# EAGLE design nopoe (EAGLE 8.4.3)
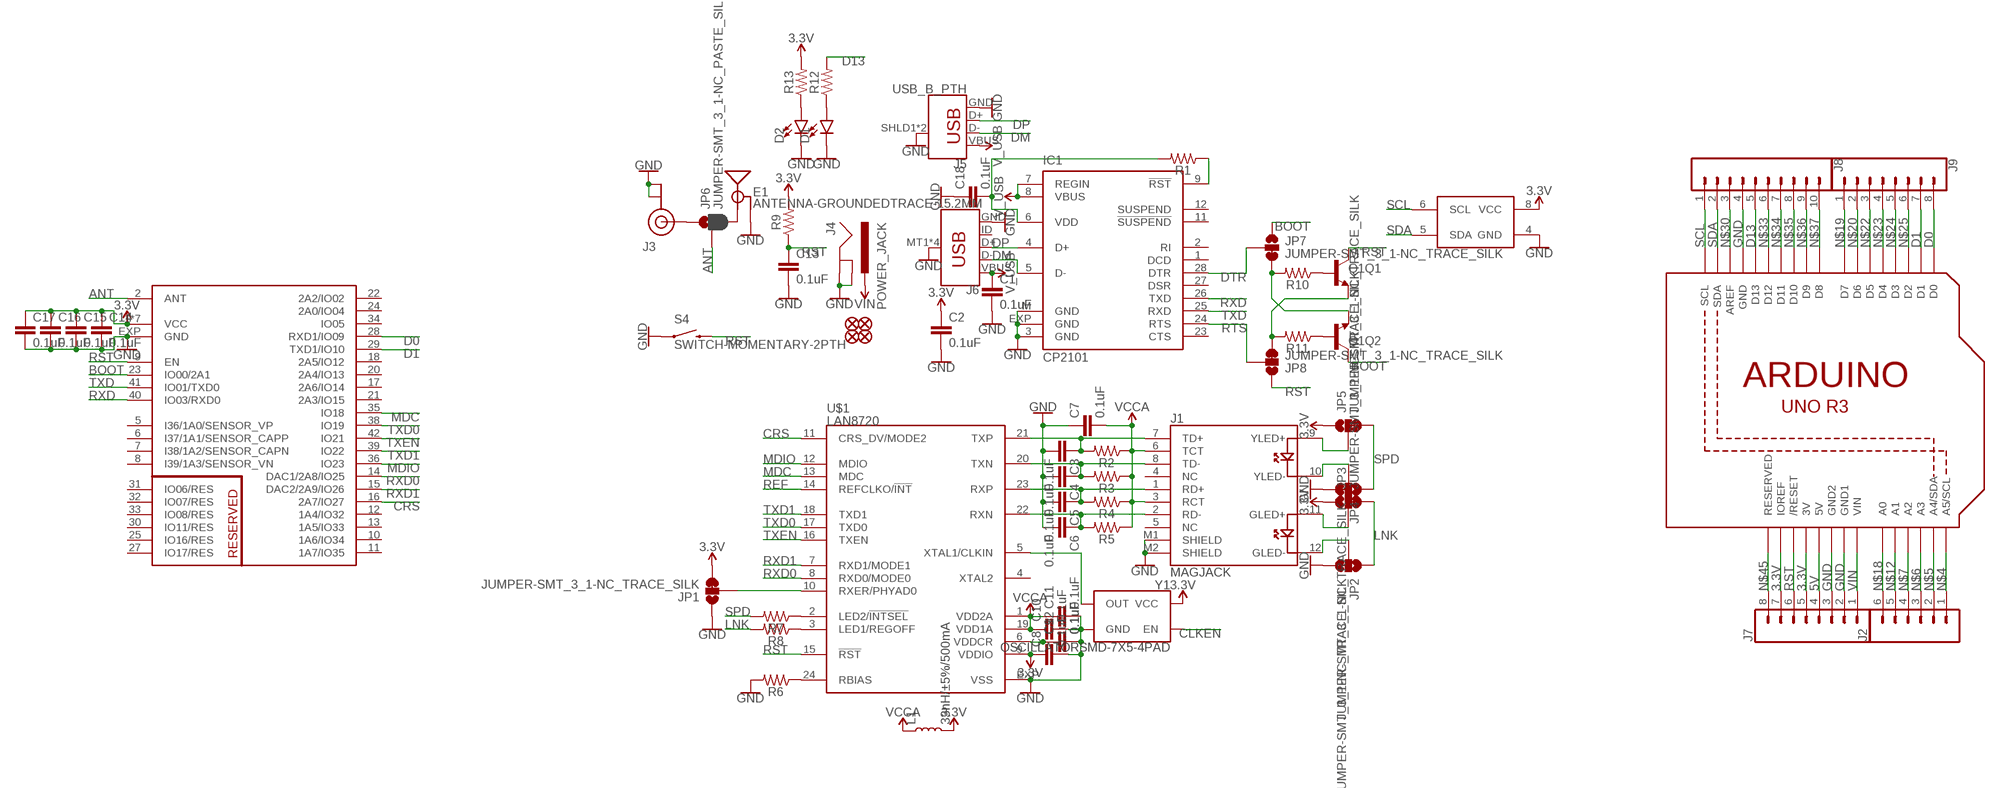
[diagram p0: schematic, sheet 1]

## Parts
C1  0.1uF  0.1UF-0603-25V-(+80/-20%)  [0603]
C2  0.1uF  0.1UF-0603-25V-(+80/-20%)  [0603]
C3  0.1uF  0.1UF-0603-25V-(+80/-20%)  [0603]
C4  0.1uF  0.1UF-0603-25V-(+80/-20%)  [0603]
C5  0.1uF  0.1UF-0603-25V-(+80/-20%)  [0603]
C6  0.1uF  0.1UF-0603-25V-(+80/-20%)  [0603]
C7  0.1uF  0.1UF-0603-25V-(+80/-20%)  [0603]
C8  0.1uF  0.1UF-0603-25V-(+80/-20%)  [0603]
C9  0.1uF  0.1UF-0603-25V-(+80/-20%)  [0603]
C10  0.1uF  0.1UF-0603-25V-(+80/-20%)  [0603]
C11  0.1uF  0.1UF-0603-25V-(+80/-20%)  [0603]
C12  0.1uF  0.1UF-0603-25V-(+80/-20%)  [0603]
C13  0.1uF  0.1UF-0603-25V-(+80/-20%)  [0603]
C14  0.1uF  0.1UF-0603-25V-(+80/-20%)  [0603]
C15  0.1uF  0.1UF-0603-25V-(+80/-20%)  [0603]
C16  0.1uF  0.1UF-0603-25V-(+80/-20%)  [0603]
C17  0.1uF  0.1UF-0603-25V-(+80/-20%)  [0603]
C18  0.1uF  0.1UF-0603-25V-(+80/-20%)  [0603]
D1  LED0603  [LED-0603]
D2  LED0603  [LED-0603]
E1  ANTENNA-GROUNDEDTRACE-15.2MM  [TRACE_ANTENNA_2.4GHZ_15.2MM]
FD1  FIDUCIAL1X2  [FIDUCIAL-1X2]
FD2  FIDUCIAL1X2  [FIDUCIAL-1X2]
FD3  FIDUCIAL1X2  [FIDUCIAL-1X2]
FD4  FIDUCIAL1X2  [FIDUCIAL-1X2]
IC1  CP2101  CP210X_USB_UART  [MLP28]
J1  MAGJACK  [MAGJACK]
J2  CONN_06NO_SILK_FEMALE_PTH  [1X06_NO_SILK]
J3  U.FL  [U.FL]
J4  POWER_JACK  [POWER_JACK_PTH]
J5  USB_B_PTH  [USB-B-PTH]
J6  USB_MICRO-B_SMT  [USB-MICROB]
J7  CONN_08NO_SILK_FEMALE_PTH  [1X08_NO_SILK]
J8  CONN_10NO_SILK_PTH_FEMALE  [1X10_NO_SILK]
J9  CONN_08NO_SILK_FEMALE_PTH  [1X08_NO_SILK]
JP1  JUMPER-SMT_3_1-NC_TRACE_SILK  [SMT-JUMPER_3_1-NC_TRACE_SILK]
JP2  JUMPER-SMT_3_1-NC_TRACE_SILK  [SMT-JUMPER_3_1-NC_TRACE_SILK]
JP3  JUMPER-SMT_3_1-NC_TRACE_SILK  [SMT-JUMPER_3_1-NC_TRACE_SILK]
JP4  JUMPER-SMT_3_1-NC_TRACE_SILK  [SMT-JUMPER_3_1-NC_TRACE_SILK]
JP5  JUMPER-SMT_3_1-NC_TRACE_SILK  [SMT-JUMPER_3_1-NC_TRACE_SILK]
JP6  JUMPER-SMT_3_1-NC_PASTE_SILK  [SMT-JUMPER_3_1-NC_PASTE_SILK]
JP7  JUMPER-SMT_3_1-NC_TRACE_SILK  [SMT-JUMPER_3_1-NC_TRACE_SILK]
JP8  JUMPER-SMT_3_1-NC_TRACE_SILK  [SMT-JUMPER_3_1-NC_TRACE_SILK]
L1  33nH/±5%/500mA  INDUCTOR-0603-33NH  [0603]
Q1  TRANS_NPN_DUAL-MBT3904DW1T1  [SC70-6]
R1  RESISTOR0603  [0603]
R2  RESISTOR0603  [0603]
R3  RESISTOR0603  [0603]
R4  RESISTOR0603  [0603]
R5  RESISTOR0603  [0603]
R6  RESISTOR0603  [0603]
R7  RESISTOR0603  [0603]
R8  RESISTOR0603  [0603]
R9  RESISTOR0603  [0603]
R10  RESISTOR0603  [0603]
R11  RESISTOR0603  [0603]
R12  RESISTOR0603  [0603]
R13  RESISTOR0603  [0603]
S4  SWITCH-MOMENTARY-2PTH  [TACTILE-PTH]
U1  ARDUINOR3-DIMENSION  [ARDUINOR3]
U2  ATSHA204_I2C-SSHDA-*  [SOIC-08]
U$1  LAN8720  [QFN24]
U$5  ESP32-PICO-D4  [QFN48_7X7]
Y1  OSCILLATORSMD-7X5-4PAD  [OSCILLATOR-SMD-7X5-4PAD]

## Nets
3.3V: C2.1 C8.1 C14.1 C15.1 C16.1 C17.1 J7.5 J7.7 JP1.3 JP3.1 JP5.1 L1.2 R9.2 R13.2 U1.3V U1.IOREF U2.8(VCC) U$1.9(VDDIO) U$5.1(VCC) U$5.3(VCC) U$5.4(VCC) U$5.19(VCC) U$5.37(VCC) U$5.43(VCC) U$5.46(VCC) Y1.4(VCC)
5V: J7.4 U1.5V
ANT: JP6.2 U$5.2(ANT)
BOOT: JP7.1 Q1.6(Q2:C) U$5.23(IO00/2A1)
CLKEN: Y1.1(EN)
CRS: U$1.11(CRS_DV/MODE2) U$5.16(2A7/IO27)
D0: J9.8 U1.D0 U$5.28(RXD1/IO09)
D1: J9.7 U1.D1 U$5.29(TXD1/IO10)
D13: J8.5 R12.2 U1.D13
DM: IC1.5(D-) J5.D- J6.D-
DP: IC1.4(D+) J5.D+ J6.D+
DTR: IC1.28(DTR) JP7.2
ECORE: C9.1 C12.1 U$1.6(VDDCR)
GND: C1.2 C2.2 C3.2 C4.2 C5.2 C6.2 C7.1 C8.2 C9.2 C10.2 C11.2 C12.2 C13.2 C14.2 C15.2 C16.2 C17.2 C18.1 D1.C D2.C E1.GND IC1.3(GND) IC1.EXP(GND) IC1.M(GND) J1.M1(SHIELD) J1.M2(SHIELD) J3.1(GND) J3.2(GND) J4.GND J4.GNDBREAK J5.GND J5.SHLD1(SHIELD) J5.SHLD2(SHIELD) J6.GND J6.MT1(SHIELD) J6.MT2(SHIELD) J6.P$1(SHIELD) J6.P$2(SHIELD) J7.2 J7.3 J8.4 JP1.1 JP2.3 JP4.3 R6.2 S4.1 S4.2 U1.GND U1.GND1 U1.GND2 U2.4(GND) U$1.EXP(VSS) U$5.EXP(GND) Y1.2(GND)
LNK: JP2.1 JP3.3 R8.2
MDC: U$1.13(MDC) U$5.35(IO18)
MDIO: U$1.12(MDIO) U$5.36(IO23)
N$3: IC1.9(!RST) R1.1
N$4: J2.1 U1.A5(A5/SCL)
N$5: J2.2 U1.A4(A4/SDA)
N$6: J2.3 U1.A3
N$7: J2.4 U1.A2
N$8: J1.12(GLED-) JP2.2
N$9: J1.11(GLED+) JP3.2
N$10: J1.10(YLED-) JP4.2
N$11: J1.9(YLED+) JP5.2
N$12: J2.5 U1.A1
N$13: R7.1 U$1.2(LED2/!INTSEL)
N$14: R8.1 U$1.3(LED1/REGOFF)
N$15: E1.ANT(SIGNAL) JP6.3
N$16: J3.FEED(SIGNAL) JP6.1
N$17: R6.1 U$1.24(RBIAS)
N$18: J2.6 U1.A0
N$19: J9.1 U1.D7
N$20: J9.2 U1.D6
N$21: JP1.2 U$1.10(RXER/PHYAD0)
N$22: J9.3 U1.D5
N$23: J9.4 U1.D4
N$24: J9.5 U1.D3
N$25: J9.6 U1.D2
N$26: U$1.5(XTAL1/CLKIN) Y1.3(OUT)
N$27: C18.2 IC1.6(VDD) R1.2
N$28: D1.A R12.1
N$29: Q1.5(Q1:B) R10.1
N$30: J8.3 U1.AREF
N$31: JP7.3 Q1.1(Q2:E) R10.2
N$32: D2.A R13.1
N$33: J8.6 U1.D12
N$34: J8.7 U1.D11
N$35: J8.8 U1.D10
N$36: J8.9 U1.D9
N$37: J8.10 U1.D8
N$38: Q1.2(Q2:B) R11.1
N$39: JP8.3 Q1.4(Q1:E) R11.2
N$45: J7.8 U1.RESERVED
REF: U$1.14(REFCLKO/!INT)
RST: C13.1 J7.6 JP8.1 Q1.3(Q1:C) R9.1 S4.3 S4.4 U1.RESET(/RESET) U$1.15(!RST) U$5.9(EN)
RTS: IC1.24(RTS) JP8.2
RXD: IC1.26(TXD) U$5.40(IO03/RXD0)
RXD0: U$1.8(RXD0/MODE0) U$5.14(DAC1/2A8/IO25)
RXD1: U$1.7(RXD1/MODE1) U$5.15(DAC2/2A9/IO26)
RXN: C6.1 J1.2(RD-) R5.2 U$1.22(RXN)
RXP: C5.1 J1.1(RD+) R4.2 U$1.23(RXP)
SCL: J8.1 U1.SCL U2.6(SCL)
SDA: J8.2 U1.SDA U2.5(SDA)
SPD: JP4.1 JP5.3 R7.2
TXD: IC1.25(RXD) U$5.41(IO01/TXD0)
TXD0: U$1.17(TXD0) U$5.38(IO19)
TXD1: U$1.18(TXD1) U$5.39(IO22)
TXEN: U$1.16(TXEN) U$5.42(IO21)
TXN: C4.1 J1.8(TD-) R3.2 U$1.20(TXN)
TXP: C3.1 J1.7(TD+) R2.2 U$1.21(TXP)
V_USB: C1.1 IC1.7(REGIN) IC1.8(VBUS) J5.VBUS J6.VBUS
VCCA: C7.2 C10.1 C11.1 J1.3(RCT) J1.6(TCT) L1.1 R2.1 R3.1 R4.1 R5.1 U$1.1(VDD2A) U$1.19(VDD1A)
VIN: J4.PWR J7.1 U1.VIN
Unconnected: IC1.1(DCD) IC1.2(RI) IC1.11(!SUSPEND) IC1.12(SUSPEND) IC1.23(CTS) IC1.27(DSR) J1.4(NC) J1.5(NC) J6.ID U$1.4(XTAL2) U$5.5(I36/1A0/SENSOR_VP) U$5.6(I37/1A1/SENSOR_CAPP) U$5.7(I38/1A2/SENSOR_CAPN) U$5.8(I39/1A3/SENSOR_VN) U$5.10(1A6/IO34) U$5.11(1A7/IO35) U$5.12(1A4/IO32) U$5.13(1A5/IO33) U$5.17(2A6/IO14) U$5.18(2A5/IO12) U$5.20(2A4/IO13) U$5.21(2A3/IO15) U$5.22(2A2/IO02) U$5.24(2A0/IO04) U$5.25(IO16/RES) U$5.27(IO17/RES) U$5.30(IO11/RES) U$5.31(IO06/RES) U$5.32(IO07/RES) U$5.33(IO08/RES) U$5.34(IO05)

## Library data of the parts
C1-C18 = SparkFun-Capacitors:0.1UF: 0.1µF ceramic capacitors A capacitor is a passive two-terminal electrical component used to store electrical energy temporarily in an electric field.; PROD_ID: CAP-00810
D1 D2 = SparkFun-LED:LED: LED (Generic) Standard schematic elements and footprints for 5mm, 3mm, 1206, and 0603 sized LEDs. Generic LEDs with no color specified.
E1 = SparkFun-RF:ANTENNA-GROUNDED: Antenna w/ Ground Connection 2.4GHz antennae with signal and ground terminals. TRACE_ANTENNA_2.4GHZ_15.2MM - Meander Trace antenna 15.2 x 5.7mm footprint Based on layout from TI app note AN043 <http://www.ti.com/lit/an/swra117d/swra117d.pdf>. TRACE_ANTENNA_2.4GHZ_25.7MM - Inverted F trace antenna 25.7 x 7.5 mm footprint. Based on layout from TI design note DN0007 <http://www.ti.com/lit/an/swru120b/swru120b.pdf>.
FD1-FD4 = SparkFun-Aesthetics:FIDUCIAL: Fiducial Alignment Points Point-of-reference for pick-and-place machines and other optical instruments.
IC1 = SparkFun-Retired:CP210X_USB_UART: Single-Chip USB to UART Bridge Source: www.silabs.com .. CP2101.pdf / cp2102.pdf. Spark Fun Electronics SKU : COM-00310 RETIRED: IC-00865; PROD_ID: COM-00310
J1 = SparkFun-Connectors:MAGJACK: MAGJACK: RJ-45 with LEDs This is a single port, RJ45 ethernet jacks with built in transformer (magnetics), status LEDs, and shielding. Here is the connector we sell at SparkFun: RJ45 Ethernet MagJack-Compatible <https://www.sparkfun.com/products/8534> (PRT-08534) Datasheet <http://www.sparkfun.com/datasheets/Prototyping/MagJack.pdf> It is used on this SparkFun product: SparkFun RJ45 MagJack Breakout <https://www.sparkfun.com/products/13021> (BOB-13021); PROD_ID: CONN-09556; SF_ID: PRT-08534
J2 = SparkFun-Connectors:CONN_06: Multi connection point. Often used as Generic Header-pin footprint for 0.1 inch spaced/style header connections On any of the 0.1 inch spaced packages, you can populate with these: Break Away Headers - Straight <https://www.sparkfun.com/products/116> (PRT-00116) Break Away Male Headers - Right Angle <https://www.sparkfun.com/products/553> (PRT-00553) Female Headers <https://www.sparkfun.com/products/115> (PRT-00115) Break Away Headers - Machine Pin <https://www.sparkfun.com/products/117> (PRT-00117) Break Away Female Headers - Swiss Machine Pin <https://www.sparkfun.com/products/743> (PRT-00743) Arduino Stackable Header - 6 Pin <https://www.sparkfun.com/products/9280> (PRT-09280) For SCREWTERMINALS and SPRING TERMINALS visit here: Screw Terimnals on SparkFun.com <https://www.sparkfun.com/search/results?term=Screw+Terminals> (5mm/3.5mm/2.54mm spacing) This device is also useful as a general connection point to wire up your design to another part of your project. Our various solder wires solder well into these plated through hole pads. Hook-Up Wire - Assortment (Stranded, 22 AWG) <https://www.sparkfun.com/products/11375> (PRT-11375) Hook-Up Wire - Assortment (Solid Core, 22 AWG) <https://www.sparkfun.com/products/11367> (PRT-11367) View the entire wire category on our website here <https://www.sparkfun.com/categories/141>; PROD_ID: CONN-08437
J3 = SparkFun-Connectors:U.FL: SMD Antenna Connector - U.FL 2mm height, 3.0mm x 3.0mm receptacle size. SparkFun Products: SparkFun WiFi Shield - ESP8266 <https://www.sparkfun.com/products/13287> SparkFun ESP8266 Thing <https://www.sparkfun.com/products/13231> SparkFun MiniGen - Pro Mini Signal Generator Shield <https://www.sparkfun.com/products/11420>; PROD_ID: CONN-09193; SF_ID: WRL-09144
J4 = SparkFun-Connectors:POWER_JACK: Power Jack Connector This is the standard 5.5mm barrel jack for power. The PTH is the most common, proven, reliable, footprint. The Slot footprint only works if the mill layer is transmitted to the PCB fab house so be warned. Here are the connectors we sell at SparkFun: DC Barrel Power Jack/Connector <https://www.sparkfun.com/products/119> (PRT-00119) DC Barrel Power Jack/Connector (SMD) <https://www.sparkfun.com/products/12748> (PRT-12748) DC Barrel Jack Adapter - Breadboard Compatible <https://www.sparkfun.com/products/10811> (PRT-10811) It is used on this SparkFun product (and many, many others): SparkFun RedBoard - Programmed with Arduino <https://www.sparkfun.com/products/12757> (DEV-12757) Also, if you need a mating power supply or connector, please check these out: Wall Adapter Power Supply - 9VDC 650mA <https://www.sparkfun.com/products/298> (TOL-00298) DC Barrel Jack Adapter - Male <https://www.sparkfun.com/products/10287> (PRT-10287); PROD_ID: CONN-08197
J5 = SparkFun-Connectors:USB_B: USB Type B Connector SparkFun Products: SparkFun Stepoko <https://www.sparkfun.com/products/13899> PTH; PROD_ID: CONN-08278; SF_ID: PRT-00139
J6 = SparkFun-Connectors:USB_MICRO-B: USB Type Micro-B Connector Male/female and PTH/SMT variants SparkFun Products: SparkFun microB USB Breakout <https://www.sparkfun.com/products/12035> SparkFun USB microB Plug Breakout <https://www.sparkfun.com/products/10031> SparkFun ESP8266 Thing <https://www.sparkfun.com/products/13231>; PROD_ID: CONN-09505; SF_ID: PRT-08533
J7 J9 = SparkFun-Connectors:CONN_08: Multi connection point. Often used as Generic Header-pin footprint for 0.1 inch spaced/style header connections On any of the 0.1 inch spaced packages, you can populate with these: Break Away Headers - Straight <https://www.sparkfun.com/products/116> (PRT-00116) Break Away Male Headers - Right Angle <https://www.sparkfun.com/products/553> (PRT-00553) Female Headers <https://www.sparkfun.com/products/115> (PRT-00115) Break Away Headers - Machine Pin <https://www.sparkfun.com/products/117> (PRT-00117) Break Away Female Headers - Swiss Machine Pin <https://www.sparkfun.com/products/743> (PRT-00743) Arduino Stackable Header - 8 Pin <https://www.sparkfun.com/products/9279> (PRT-09279) For SCREWTERMINALS and SPRING TERMINALS visit here: Screw Terimnals on SparkFun.com <https://www.sparkfun.com/search/results?term=Screw+Terminals> (5mm/3.5mm/2.54mm spacing) This device is also useful as a general connection point to wire up your design to another part of your project. Our various solder wires solder well into these plated through hole pads. Hook-Up Wire - Assortment (Stranded, 22 AWG) <https://www.sparkfun.com/products/11375> (PRT-11375) Hook-Up Wire - Assortment (Solid Core, 22 AWG) <https://www.sparkfun.com/products/11367> (PRT-11367) View the entire wire category on our website here <https://www.sparkfun.com/categories/141> Special notes: Molex polarized connector foot print use with SKU : PRT-08231 with associated crimp pins and housings. 1MM SMD Version SKU: PRT-10208 NOTES ON THE VARIANTS LOCK and LOCK_LONGPADS... This footprint was designed to help hold the alignment of a through-hole component (i.e. 6-pin header) while soldering it into place. You may notice that each hole has been shifted either up or down by 0.005 of an inch from it's more standard position (which is a perfectly straight line). This slight alteration caused the pins (the squares in the middle) to touch the edges of the holes. Because they are alternating, it causes a "brace" to hold the component in place. 0.005 has proven to be the perfect amount of "off-center" position when using our standard breakaway headers. Although looks a little odd when you look at the bare footprint, once you have a header in there, the alteration is very hard to notice. Also,if you push a header all the way into place, it is covered up entirely on the bottom side.; PROD_ID: CONN-08438
J8 = SparkFun-Connectors:CONN_10: Multi connection point. Often used as Generic Header-pin footprint for 0.1 inch spaced/style header connections On any of the 0.1 inch spaced packages, you can populate with these: Break Away Headers - Straight <https://www.sparkfun.com/products/116> (PRT-00116) Break Away Male Headers - Right Angle <https://www.sparkfun.com/products/553> (PRT-00553) Female Headers <https://www.sparkfun.com/products/115> (PRT-00115) Break Away Headers - Machine Pin <https://www.sparkfun.com/products/117> (PRT-00117) Break Away Female Headers - Swiss Machine Pin <https://www.sparkfun.com/products/743> (PRT-00743) Arduino Stackable Header - 10 Pin <https://www.sparkfun.com/products/11376> (PRT-11376) For SCREWTERMINALS and SPRING TERMINALS visit here: Screw Terimnals on SparkFun.com <https://www.sparkfun.com/search/results?term=Screw+Terminals> (5mm/3.5mm/2.54mm spacing) This device is also useful as a general connection point to wire up your design to another part of your project. Our various solder wires solder well into these plated through hole pads. Hook-Up Wire - Assortment (Stranded, 22 AWG) <https://www.sparkfun.com/products/11375> (PRT-11375) Hook-Up Wire - Assortment (Solid Core, 22 AWG) <https://www.sparkfun.com/products/11367> (PRT-11367) View the entire wire category on our website here <https://www.sparkfun.com/categories/141> Special notes: Molex polarized connector foot print use with SKU : PRT-08231 with associated crimp pins and housings. 1MM SMD Version SKU: PRT-10208 NOTES ON THE VARIANTS LOCK and LOCK_LONGPADS... This footprint was designed to help hold the alignment of a through-hole component (i.e. 6-pin header) while soldering it into place. You may notice that each hole has been shifted either up or down by 0.005 of an inch from it's more standard position (which is a perfectly straight line). This slight alteration caused the pins (the squares in the middle) to touch the edges of the holes. Because they are alternating, it causes a "brace" to hold the component in place. 0.005 has proven to be the perfect amount of "off-center" position when using our standard breakaway headers. Although looks a little odd when you look at the bare footprint, once you have a header in there, the alteration is very hard to notice. Also,if you push a header all the way into place, it is covered up entirely on the bottom side.; PROD_ID: CONN-11563
JP1-JP5 JP7 JP8 = SparkFun-Jumpers:JUMPER-SMT_3_1-NC_TRACE: Normally closed trace jumper (1 of 2 connections) This jumper has a trace between two pads so it's normally closed (NC). The other connection is normally open (NO). Use a razor knife to open the connection. For best results follow the IPC guidelines for cutting traces: Cutout at least 0.063 mm (0.005 in). Remove all loose material to clean up the cut area. Seal the cut with an approved epoxy. Reapply solder to reclose the connection, or to close the NO connection.
JP6 = SparkFun-Jumpers:JUMPER-SMT_3_1-NC_PASTE: Normally closed solder jumper (1 of 2 connections) This jumper has an aperture in the stencil to allow solder paste to bridge one of the two connections. One connection is normally closed (NC), while the other is normally open (NO). Wick off the solder to open the connection. Reapply solder to reclose the connection. Apply solder to the other side instead to change the current path.
L1 = SparkFun-Coils:INDUCTOR: Inductors Resist changes in electrical current. Basically a coil of wire. SparkFun Products: SparkFun Load Cell Amplifier - HX711 <https://www.sparkfun.com/products/13879> IOIO-OTG - V2.2 <https://www.sparkfun.com/products/13613>; PROD_ID: NDUC-07874
Q1 = SparkFun-DiscreteSemi:TRANS_NPN_DUAL: Dual NPN Transistors in Single Package The MBT3904W1 puts two general purpose 3904 NPN transistors in a single package. Datasheet <http://www.onsemi.com/pub_link/Collateral/MBT3904DW1T1-D.PDF> SparkFun Products: SparkFun ESP32 Thing <https://www.sparkfun.com/products/13907>; PROD_ID: TRANS-13337
R1-R13 = SparkFun-Resistors:RESISTOR: Generic Resistor Package
S4 = maxorig:SWITCH-MOMENTARY-2: Various NO switches- pushbuttons, reed, etc; PROD_ID: SWCH-08441
U1 = adafruit:ARDUINOR3: This is a new object for the new Arduino R3 - with extra pins that you may want to use (such as IOref, and duplicated A4/A5
U2 = maxorig:ATSHA204_I2C: ATSHA204 I2C - Atmel Crypto Element w/ 4.5Kb EEPROM The Atmel ATSHA204 is an optimized authentication chip that includes a 4.5Kb EEPROM. This array can be used for storage of keys, miscellaneous read/write, read-only, password or secret data, and consumption tracking. Access to the various sections of memory can be restricted in a variety of ways and then the configuration locked to prevent changes. This part is for the I2C version of the ATSHA204A. Technical specifications: Supply voltage: 2.0-5.5V Communication voltage: 1.8-5.5V 512 bit OTP (One Time Programmable) region Guaranteed unique 72-bit serial number Internal, high-quality RNG (Random Number Generator) Hardware SHA-256 accelerator
U$1 = microchip-smsc-lan8720:LAN8720: LAN8720A/LAN8720Ai Small Footprint RMII 10/100 Ethernet PHY Transceiver with HP Auto-MDIX Support from SMSC / Microchip <http://www.microchip.com>. (C) 2014 Tomasz Boleslaw CEDRO, cederom@tlen.pl, http://www.tomek.cedro.info. Version 0.1 (2014-01-04): Initial release.
U$5 = maxorig:ESP32-PICO-D4: ESP32-PICO-D4 - ESP32 with integrated flash and passives This SIP (System In Package) integrates the amazing ESP32 wifi capable microcontroller along with an SPI flash chip, crystal, RF passives, and decoupling capacitors. You can use this piece just like the ESP32 but without the need for RF design or picking a suitable flash chip and passives. Reserved pins are attached internally to the flash chip, and should be left disconnected unless you are sure your application requires it. Techinical specifications: VCC: 3.3V Flash size: 4Mbytes ADC resolution: 12 bits Generally usable ADC pins: 13 Truly usable IO: 21 Total IO: 34
Y1 = SparkFun-Clocks:OSCILLATOR: Oscillators (Generic) These are active oscillators, which require a power source to generate their clock output. Most oscillators are configured to generate a set frequency (e.g. 16MHz). They have four pins: power, ground, output, and an enable input.

## Board
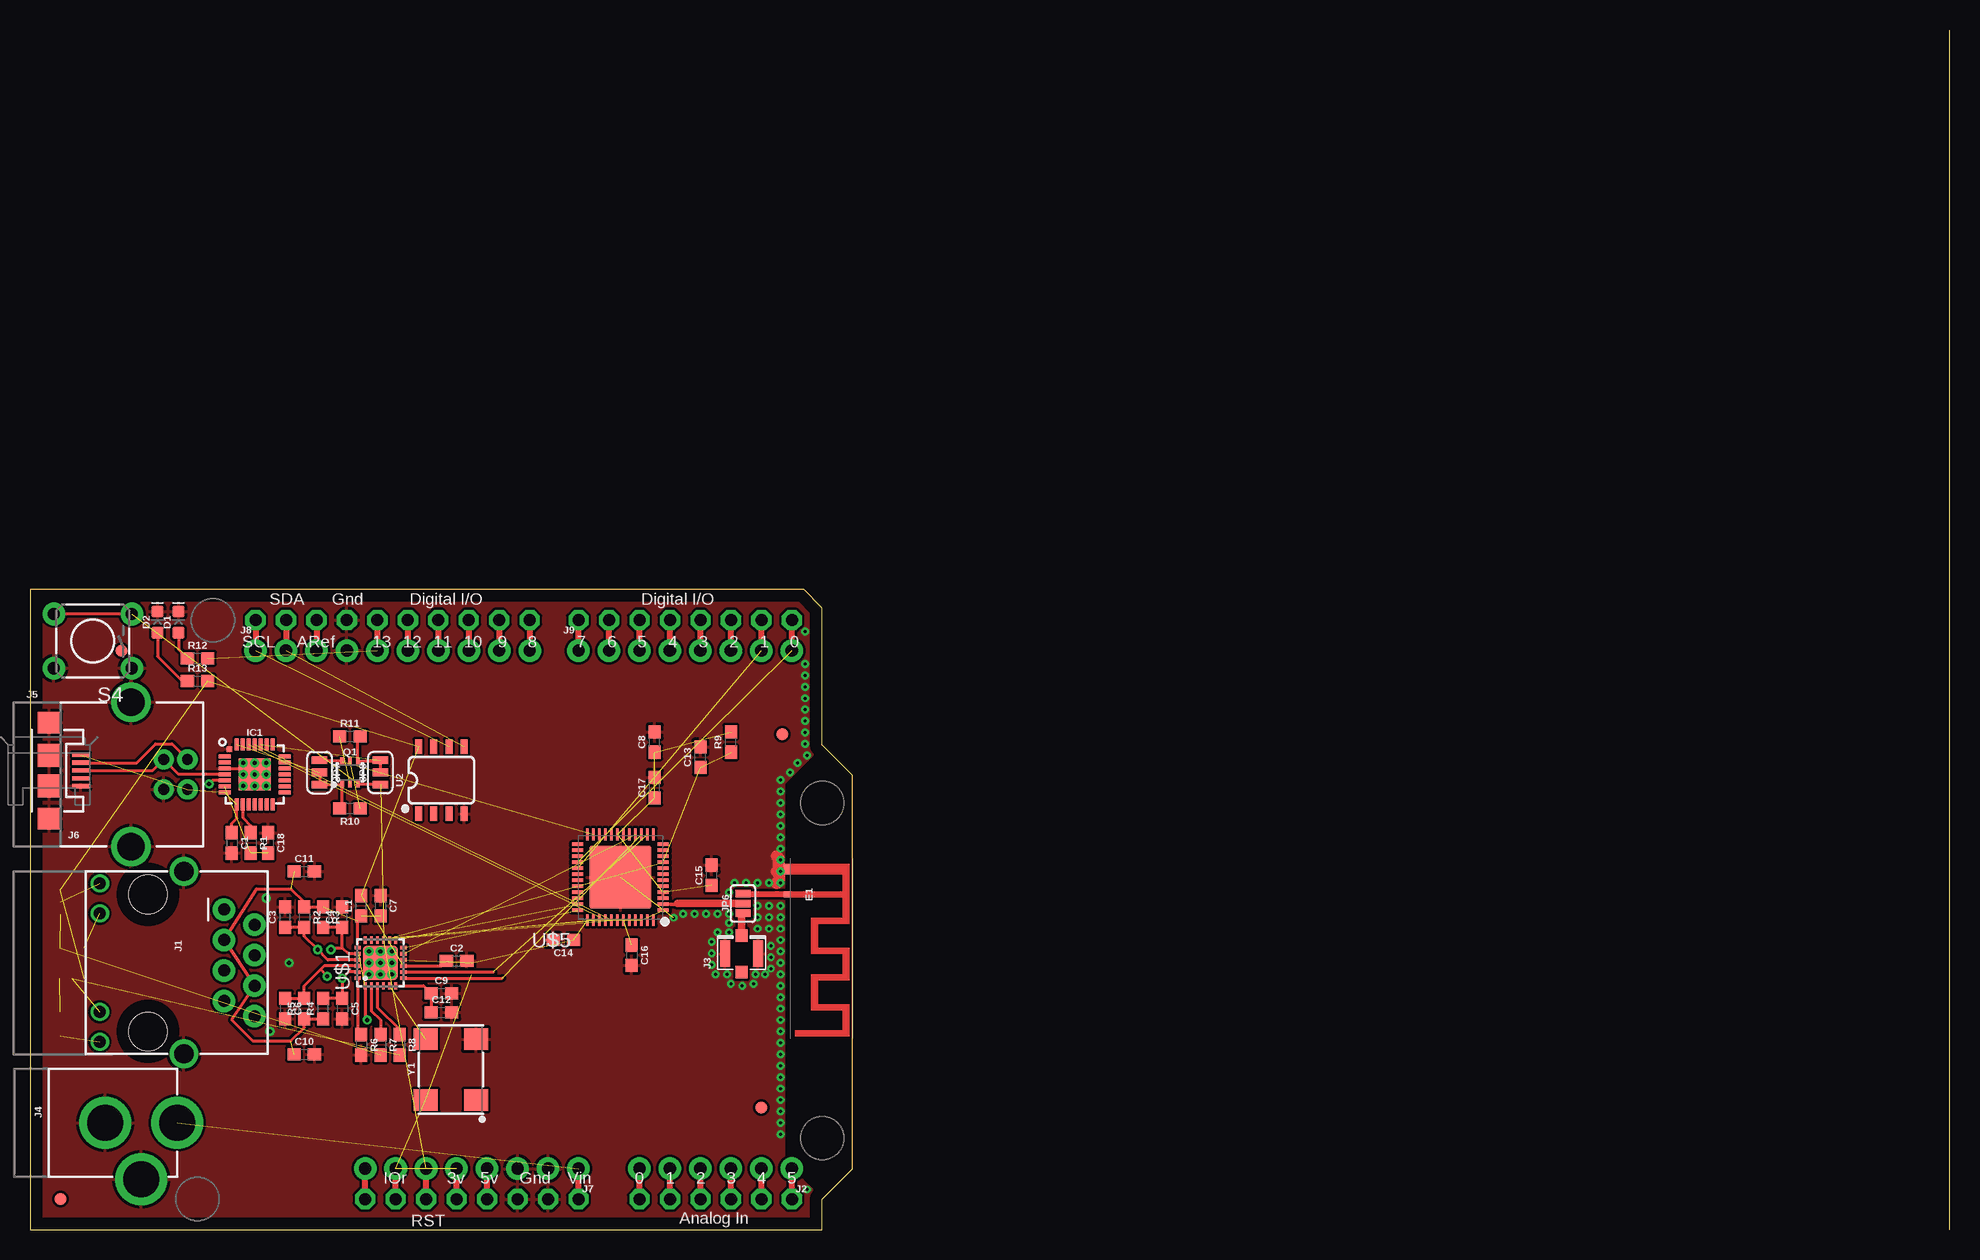
[diagram p1: board, top side]
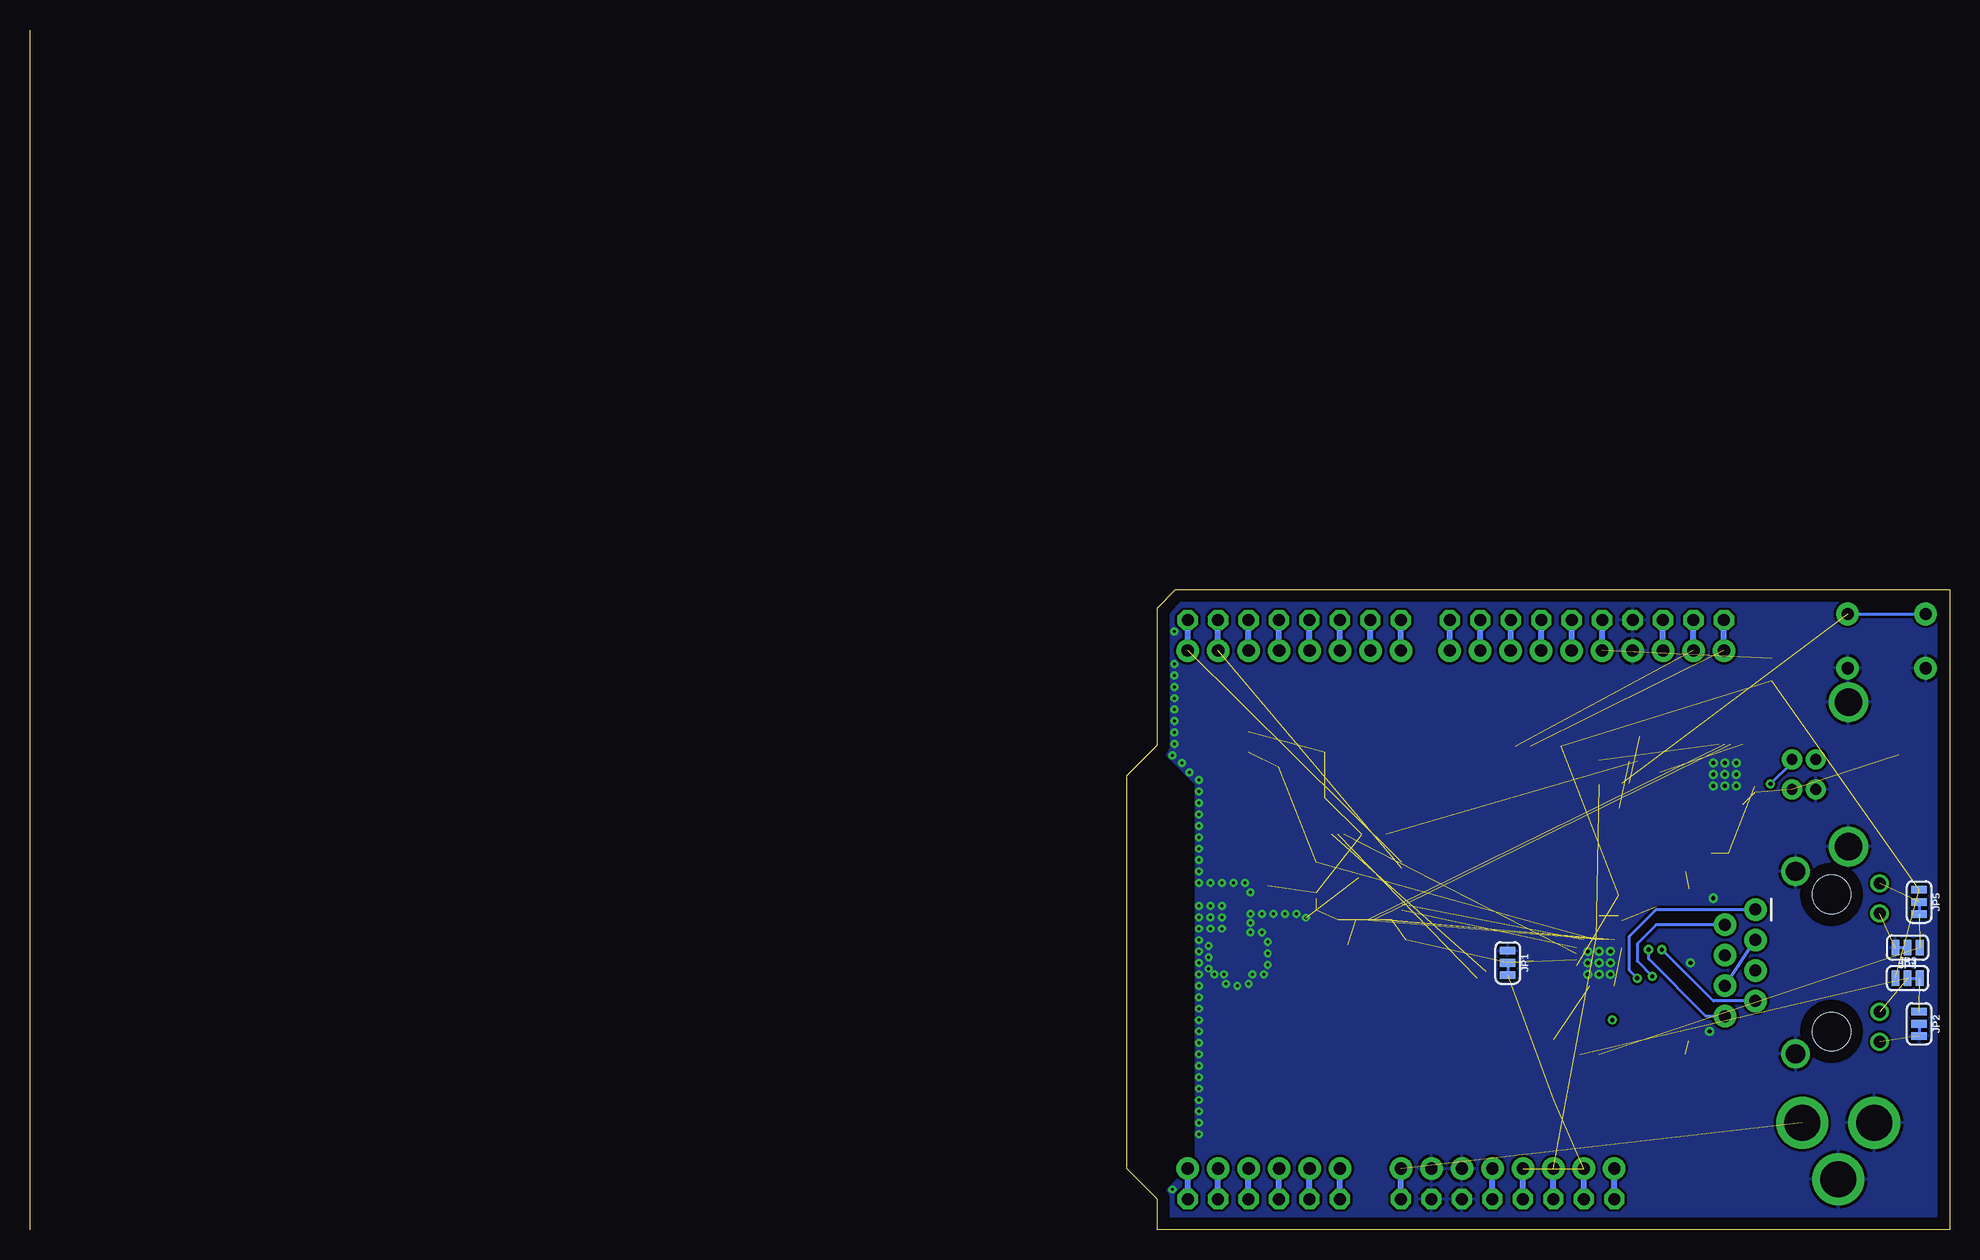
[diagram p2: board, bottom side, seen from below]

Size 160 x 100 mm. Coordinates in mm from the lower left corner, seen from the top.
Outline: 160,0 160,100
Copper layers (1*16): Top 0.035mm / dielectric 1.5mm / Bottom 0.035mm
Design rules "default": minimum track width 10mil, minimum drill 24mil, track to track 8mil, track to pad 8mil, pad to pad 8mil, via to via 8mil, smd to smd 8mil, copper to edge 40mil, drill to drill 8mil, minimum pad ring 10mil, minimum via ring 8mil, stop-mask expansion 4mil, vias tented up to drill 0mil, thermal gap 10mil

### Footprints (pad centres in the part's own frame; a part is rotated, then mirrored left to right if it is on the bottom)
0603 = smd 1.1 x 1: 1 -0.85,0; 2 0.85,0
LED-0603 = smd 1 x 1: A -0.877,0; C 0.877,0
TRACE_ANTENNA_2.4GHZ_15.2MM = smd 0.5 x 0.5: ANT 0,-0.25 | smd 0.9 x 0.5: GND -2.1,-0.25
FIDUCIAL-1X2 = smd 1 x 1: 1 0,0
MLP28 = smd 1 x 0.3: 1 -2.5,1.5; 2 -2.5,1; 3 -2.5,0.5; 4 -2.5,0; 5 -2.5,-0.5; 6 -2.5,-1; 7 -2.5,-1.5; 15 2.5,-1.5; 16 2.5,-1; 17 2.5,-0.5; 18 2.5,0; 19 2.5,0.5; 20 2.5,1; 21 2.5,1.5 | smd 0.3 x 1: 8 -1.5,-2.5; 9 -1,-2.5; 10 -0.5,-2.5; 11 0,-2.5; 12 0.5,-2.5; 13 1,-2.5; 14 1.5,-2.5; 22 1.5,2.5; 23 1,2.5; 24 0.5,2.5; 25 0,2.5; 26 -0.5,2.5; 27 -1,2.5; 28 -1.5,2.5 | smd 2.7 x 2.7: EXP 0,0 | smd 0.435 x 0.435: M -2.103,2.103
MAGJACK = drill 1 pad 1.88: 1 3.175,17.445; 2 4.445,19.985; 3 5.715,17.445; 4 6.985,19.985; 5 8.255,17.445; 6 9.525,19.985; 7 10.795,17.445; 8 12.065,19.985 | drill 1 pad 1.27: 9 1,7.1; 10 3.5,7.1; 11 11.7,7.1; 12 14.2,7.1 | drill 1.6 pad 2.184: M1 0,14.1; M2 15.2,14.1 | hole 3.2: 1.905,11.095; 13.335,11.095
1X06_NO_SILK = drill 1.016 pad 1.88: 1 0,0; 2 2.54,0; 3 5.08,0; 4 7.62,0; 5 10.16,0; 6 12.7,0
U.FL = smd 2.2 x 0.85: 1 0,1.375; 2 0,-1.375 | smd 1.05 x 1: FEED 1.525,0; NC -1.525,0
POWER_JACK_PTH = drill 2.997 pad 4.318: GND 0,7.7; GNDBREAK 4.7,10.7; PWR 0,13.7
USB-B-PTH = drill 0.914 pad 1.676: D+ 4,1.25; D- 5.981,1.25; GND 4,-1.25; VBUS 5.981,-1.25 | drill 2.286: SHLD1 1.282,-6.02; SHLD2 1.282,6.02
USB-MICROB = smd 1.4 x 0.35: D+ -2.65,0; D- -2.65,-0.65; GND -2.65,1.3; ID -2.65,0.65; VBUS -2.65,-1.3 | smd 1.9 x 1.8: MT1 0,-4; MT2 0,4 | smd 1.9 x 1.9: P$1 0,-1.27; P$2 0,1.27
1X08_NO_SILK = drill 1.016 pad 1.88: 1 0,0; 2 2.54,0; 3 5.08,0; 4 7.62,0; 5 10.16,0; 6 12.7,0; 7 15.24,0; 8 17.78,0
1X10_NO_SILK = drill 1.016 pad 1.88: 1 0,0; 2 2.54,0; 3 5.08,0; 4 7.62,0; 5 10.16,0; 6 12.7,0; 7 15.24,0; 8 17.78,0; 9 20.32,0; 10 22.86,0
SMT-JUMPER_3_1-NC_TRACE_SILK = smd 0.635 x 1.27: 1 -1.016,0; 2 0,0; 3 1.016,0
SMT-JUMPER_3_1-NC_PASTE_SILK = smd 0.635 x 1.27: 1 -0.813,0; 2 0,0; 3 0.813,0
SC70-6 = smd 0.3 x 0.66: 1 -0.65,-0.92; 2 0,-0.92; 3 0.65,-0.92; 4 0.65,0.92; 5 0,0.92; 6 -0.65,0.92
TACTILE-PTH = drill 1.016 pad 1.88: 1 -3.251,2.261; 2 3.251,2.261; 3 -3.251,-2.261; 4 3.251,-2.261
ARDUINOR3 = drill 1 pad 1.676 octagon: 3V 35.56,2.54; 5V 38.1,2.54; A0 50.8,2.54; A1 53.34,2.54; A2 55.88,2.54; A3 58.42,2.54; A4 60.96,2.54; A5 63.5,2.54; AREF 23.876,50.8; D0 63.5,50.8; D1 60.96,50.8; D2 58.42,50.8; D3 55.88,50.8; D4 53.34,50.8; D5 50.8,50.8; D6 48.26,50.8; D7 45.72,50.8; D8 41.656,50.8; D9 39.116,50.8; D10 36.576,50.8; D11 34.036,50.8; D12 31.496,50.8; D13 28.956,50.8; GND 26.416,50.8; GND1 43.18,2.54; GND2 40.64,2.54; IOREF 30.48,2.54; RESERVED 27.94,2.54; RESET 33.02,2.54; SCL 18.796,50.8; SDA 21.336,50.8; VIN 45.72,2.54
SOIC-08 = smd 0.6 x 1.2: 1 -1.905,-2.8; 2 -0.635,-2.8; 3 0.635,-2.8; 4 1.905,-2.8; 5 1.905,2.8; 6 0.635,2.8; 7 -0.635,2.8; 8 -1.905,2.8
QFN24 = smd 0.6 x 0.3: 1 -1.905,1.27; 2 -1.905,0.762; 3 -1.905,0.254; 4 -1.905,-0.254; 5 -1.905,-0.762; 6 -1.905,-1.27; 13 1.905,-1.27; 14 1.905,-0.762; 15 1.905,-0.254; 16 1.905,0.254; 17 1.905,0.762; 18 1.905,1.27 | smd 0.3 x 0.6: 7 -1.27,-1.905; 8 -0.762,-1.905; 9 -0.254,-1.905; 10 0.254,-1.905; 11 0.762,-1.905; 12 1.27,-1.905; 19 1.27,1.905; 20 0.762,1.905; 21 0.254,1.905; 22 -0.254,1.905; 23 -0.762,1.905; 24 -1.27,1.905 | smd 2.9 x 2.9: EXP 0,0
QFN48_7X7 = smd 1 x 0.3: 1 -3.575,2.75; 2 -3.575,2.25; 3 -3.575,1.75; 4 -3.575,1.25; 5 -3.575,0.75; 6 -3.575,0.25; 7 -3.575,-0.25; 8 -3.575,-0.75; 9 -3.575,-1.25; 10 -3.575,-1.75; 11 -3.575,-2.25; 12 -3.575,-2.75; 25 3.575,-2.75; 26 3.575,-2.25; 27 3.575,-1.75; 28 3.575,-1.25; 29 3.575,-0.75; 30 3.575,-0.25; 31 3.575,0.25; 32 3.575,0.75; 33 3.575,1.25; 34 3.575,1.75; 35 3.575,2.25; 36 3.575,2.75 | smd 0.3 x 1: 13 -2.75,-3.575; 14 -2.25,-3.575; 15 -1.75,-3.575; 16 -1.25,-3.575; 17 -0.75,-3.575; 18 -0.25,-3.575; 19 0.25,-3.575; 20 0.75,-3.575; 21 1.25,-3.575; 22 1.75,-3.575; 23 2.25,-3.575; 24 2.75,-3.575; 37 2.75,3.575; 38 2.25,3.575; 39 1.75,3.575; 40 1.25,3.575; 41 0.75,3.575; 42 0.25,3.575; 43 -0.25,3.575; 44 -0.75,3.575; 45 -1.25,3.575; 46 -1.75,3.575; 47 -2.25,3.575; 48 -2.75,3.575 | smd 5.2 x 5.2: EXP 0,0
OSCILLATOR-SMD-7X5-4PAD = smd 1.8 x 2: 1 -2.54,-2.095; 2 2.54,-2.095; 3 2.54,2.104; 4 -2.54,2.104

### Placement (x,y rotation side)
C1  16.83,32.23 270 top
C2  35.56,22.38 0 top
C3  21.27,26.04 90 top
C4  26.04,26.04 90 top
C5  26.04,18.41 270 top
C6  21.27,18.41 270 top
C7  29.21,26.99 270 top
C8  52.07,40.64 90 top
C9  34.29,19.68 0 top
C10  22.86,14.61 0 top
C11  22.86,29.84 0 top
C12  34.29,18.1 0 top
C13  55.88,39.37 90 top
C14  44.45,24.13 180 top
C15  56.83,29.53 90 top
C16  50.16,22.86 270 top
C17  52.07,36.83 90 top
C18  19.84,32.23 270 top
D1  12.38,50.64 90 top
D2  10.64,50.64 90 top
E1  63.37,27.94 270 top
FD1  7.62,48.26 0 top
FD2  62.71,41.27 0 top
FD3  2.54,2.54 0 top
FD4  60.96,10.16 0 top
IC1  18.73,37.94 0 top
J1  -1.27,29.84 270 top
J2  63.5,5.08 180 top
J3  59.31,22.99 90 top
J4  -1.43,8.89 270 top
J5  7.14,37.94 0 top
J6  1.59,38.26 180 top
J7  45.72,5.08 180 top
J8  18.8,48.26 0 top
J9  45.72,48.26 0 top
JP1  36.83,22.23 270 bottom
JP2  2.54,17.14 270 bottom
JP3  3.49,20.95 0 bottom
JP4  3.49,23.5 180 bottom
JP5  2.54,27.3 270 bottom
JP6  59.44,27.18 90 top
JP7  24.13,38.1 270 top
JP8  29.21,38.1 90 top
L1  27.62,26.99 90 top
Q1  26.67,38.1 0 top
R1  18.41,32.23 270 top
R2  22.86,26.04 270 top
R3  24.45,26.04 270 top
R4  24.45,18.41 90 top
R5  22.86,18.41 90 top
R6  27.62,15.4 270 top
R7  29.21,15.4 270 top
R8  30.8,15.4 270 top
R9  58.42,40.64 90 top
R10  26.67,35.08 180 top
R11  26.67,41.12 0 top
R12  13.97,47.62 0 top
R13  13.97,45.72 0 top
S4  5.24,49.05 180 top
U1  0,0 0 top
U2  34.29,37.47 0 top
U$1  29.21,22.23 90 top
U$5  49.21,29.37 180 top
Y1  35.08,13.34 90 top

### Tracks (layer width: path | path; a pad name or v marks a point on that pad's centre or on a via)
3.3V  (21 unrouted)
  Top 0.254: U$5.3 U$5.4 | U$1.9 34.3,21.97 C2.1
  Top 0.508: U1.3V J7.5 | U1.IOREF J7.7
  Bottom 0.508: U1.IOREF J7.7 | U1.3V J7.5
5V
  Top 0.508: U1.5V J7.4
  Bottom 0.508: U1.5V J7.4
ANT
  Top 0.254: 53.82,27.12 U$5.2 | 53.34,27.12 53.82,27.12 | 53.82,27.12 53.98,27.12 53.98,27.18 | 54.61,27.18 53.82,27.18 53.82,27.12
  Top 0.61: 53.98,27.18 JP6.2
BOOT  (1 unrouted)
  Top 0.254: JP7.1 25.92,39.12 Q1.6
CRS  (1 unrouted)
D0  (1 unrouted)
  Top 0.508: J9.8 U1.D0
  Bottom 0.508: J9.8 U1.D0
D1  (1 unrouted)
  Top 0.508: J9.7 U1.D1
  Bottom 0.508: J9.7 U1.D1
D13  (1 unrouted)
  Top 0.508: U1.D13 J8.5
  Bottom 0.508: J8.5 U1.D13
DM  (via drill 0.35)
  Top 0.254: J6.D- 8.9,38.91 10.48,40.48 11.84,40.48 J5.D- | IC1.5 15.22,37.44 v14.92,37.15
  Bottom 0.254: v14.92,37.15 13.12,38.95 J5.D-
DP
  Top 0.254: IC1.4 12.39,37.94 J5.D+ 10.21,38.26 J6.D+
DTR  (1 unrouted)
ECORE
  Top 0.254: U$1.6 32.8,20.32 C9.1 C12.1
GND  (via drill 0.25, 0.35)  (1 unrouted)
  Top 0.254: IC1.3 18.73,38.44 IC1.EXP
  Top 0.61: E1.GND 62.42,30.04
  Top 1.016: 62.42,30.04 62.23,29.84 | 62.42,30.04 62.42,30.92 62.23,31.11 | 62.42,30.04 62.42,29.09 62.23,28.89
  other vias: 17.78,37.94 17.78,36.99 18.73,36.99 18.73,37.94 18.73,38.89 19.68,38.89 19.68,37.94 19.68,36.99 17.78,38.89 29.21,22.23 28.26,22.23 28.26,23.18 29.21,23.18 30.16,23.18 30.16,22.23 30.16,21.27 29.21,21.27 28.26,21.27 62.55,26.99 61.59,26.99 60.64,26.99 60.64,26.04 61.59,26.04 62.55,26.04 62.55,25.08 61.59,25.08 60.64,25.08 62.55,24.13 62.55,23.18 62.55,22.23 61.75,23.65 61.75,22.7 62.55,21.27 62.55,20.32 62.55,19.37 62.55,18.41 62.55,17.46 62.55,16.51 62.55,15.56 62.55,14.61 62.55,13.65 62.55,12.7 62.55,11.75 62.55,10.79 62.55,9.84 62.55,8.89 62.55,7.94 64.77,3.33 62.55,28.89 61.59,28.89 60.64,28.89 59.69,28.89 58.74,28.89 62.55,29.84 62.55,30.8 62.55,31.75 62.55,32.7 62.55,33.66 62.55,34.61 62.55,35.56 62.55,36.51 62.55,37.47 63.34,38.1 63.98,38.89 64.77,39.53 64.61,40.48 64.61,41.43 64.61,42.39 64.61,43.34 64.61,44.29 64.61,45.24 64.61,46.2 64.61,47.15 64.61,49.85 61.75,21.75 60.48,21.27 60.33,20.48 59.37,20.32 58.42,20.48 58.1,21.27 57.15,21.27 56.83,22.07 56.83,23.02 56.83,23.97 57.31,24.77 58.26,24.77 58.26,25.56 58.26,26.31 58.26,28.1 20,16.51 19.68,27.62 21.59,22.23 61.28,21.27 57.31,26.31 56.36,26.31 55.4,26.31 54.45,26.31 53.66,26
  pour Top: 0,0 0,53.34 64.45,53.34 66.04,51.75 66.04,40.32 62.87,37.15 62.87,5.71 66.04,2.54 66.04,0
  pour Bottom: 0,0 0,53.34 64.45,53.34 66.04,51.75 66.04,40.32 62.87,37.15 62.87,5.71 66.04,2.54 66.04,0
LNK  (2 unrouted)
MDC  (1 unrouted)
MDIO  (1 unrouted)
N$1
  cutout Top: 58.42,24.13 60.33,24.13 60.33,21.91 58.42,21.91
N$2
  cutout Top: 16.83,39.85 20.64,39.85 20.64,36.04 16.83,36.04
N$3
  Top 0.254: IC1.9 17.73,34.34 18.41,33.66 R1.1
N$4
  Top 0.508: U1.A5 J2.1
  Bottom 0.508: U1.A5 J2.1
N$5
  Top 0.508: U1.A4 J2.2
  Bottom 0.508: U1.A4 J2.2
N$6
  Top 0.508: U1.A3 J2.3
  Bottom 0.508: U1.A3 J2.3
N$7
  Top 0.508: U1.A2 J2.4
  Bottom 0.508: U1.A2 J2.4
N$8  (1 unrouted)
N$9  (1 unrouted)
N$10  (1 unrouted)
N$11  (1 unrouted)
N$12
  Top 0.508: U1.A1 J2.5
  Bottom 0.508: U1.A1 J2.5
N$13
  Top 0.254: U$1.2 28.45,18.22 29.21,17.46 R7.1
N$14
  Top 0.254: U$1.3 28.96,18.51 30.8,16.67 R8.1
N$15
  Top 0.508: E1.ANT 59.51,27.94 JP6.3
N$16
  Top 0.61: J3.FEED 59.31,26.24 JP6.1
N$17
  Top 0.254: U$1.24 27.3,16.57 R6.1
N$18
  Top 0.508: U1.A0 J2.6
  Bottom 0.508: U1.A0 J2.6
N$19
  Top 0.508: J9.1 U1.D7
  Bottom 0.508: J9.1 U1.D7
N$20
  Top 0.508: J9.2 U1.D6
  Bottom 0.508: J9.2 U1.D6
N$21  (1 unrouted)
N$22
  Top 0.508: J9.3 U1.D5
  Bottom 0.508: J9.3 U1.D5
N$23
  Top 0.508: J9.4 U1.D4
  Bottom 0.508: J9.4 U1.D4
N$24
  Top 0.508: J9.5 U1.D3
  Bottom 0.508: J9.5 U1.D3
N$25
  Top 0.508: J9.6 U1.D2
  Bottom 0.508: J9.6 U1.D2
N$26  (1 unrouted)
N$27  (2 unrouted)
N$28
  Top 0.254: D1.A 12.38,48.36 R12.1
N$29  (1 unrouted)
N$30
  Top 0.508: U1.AREF J8.3
  Bottom 0.508: J8.3 U1.AREF
N$31
  Top 0.254: JP7.3 25.92,37.08 Q1.1 26.02,35.28 R10.2
N$32
  Top 0.254: D2.A 10.64,47.78 12.7,45.72 R13.1
N$33
  Top 0.508: U1.D12 J8.6
  Bottom 0.508: J8.6 U1.D12
N$34
  Top 0.508: U1.D11 J8.7
  Bottom 0.508: J8.7 U1.D11
N$35
  Top 0.508: U1.D10 J8.8
  Bottom 0.508: J8.8 U1.D10
N$36
  Top 0.508: U1.D9 J8.9
  Bottom 0.508: J8.9 U1.D9
N$37
  Top 0.508: U1.D8 J8.10
  Bottom 0.508: J8.10 U1.D8
N$38  (1 unrouted)
N$39
  Top 0.254: JP8.3 29.11,39.02 Q1.4 27.32,40.92 R11.2
N$45
  Top 0.508: U1.RESERVED J7.8
  Bottom 0.508: U1.RESERVED J7.8
RST  (6 unrouted)
  Top 0.254: S4.3 S4.4 | JP8.1 27.42,37.08 Q1.3
  Top 0.508: U1.RESET J7.6
  Bottom 0.254: S4.3 S4.4
  Bottom 0.508: U1.RESET J7.6
RTS  (1 unrouted)
RXD  (1 unrouted)
RXD0  (1 unrouted)
  Top 0.254: U$1.8 38.61,21.46
RXD1  (1 unrouted)
  Top 0.254: U$1.7 39.37,20.95
RXN  (via drill 0.35)
  Top 0.254: U$1.22 24.51,21.97 24.21,21.67 | 24.21,21.67 22.86,20.32 R5.2 C6.1 | v24.77,21.11 24.21,21.67
  Bottom 0.254: J1.2 24.45,25.4 26.04,23.81 26.04,22.38 v24.77,21.11
RXP  (via drill 0.35)
  Top 0.254: U$1.23 26.54,21.46 v26.04,20.95 C5.1 R4.2
  Bottom 0.254: J1.1 24.45,26.67 26.67,24.45 26.67,21.59 v26.04,20.95
SCL  (1 unrouted)
  Top 0.508: U1.SCL J8.1
  Bottom 0.508: J8.1 U1.SCL
SDA  (1 unrouted)
  Top 0.508: U1.SDA J8.2
  Bottom 0.508: J8.2 U1.SDA
SPD  (2 unrouted)
TXD  (1 unrouted)
TXD0  (1 unrouted)
TXD1  (1 unrouted)
TXEN  (1 unrouted)
TXN  (via drill 0.35)
  Top 0.254: R3.2 C4.1 26.04,23.5 | U$1.20 26.54,22.99 26.04,23.5 | v25.08,23.34 25.24,23.5 26.04,23.5
  Bottom 0.254: J1.8 20.32,17.78 25.08,22.54 v25.08,23.34
TXP  (via drill 0.35)
  Top 0.254: U$1.21 24.83,22.48 v23.97,23.34 22.86,24.45 R2.2 C3.1
  Bottom 0.254: J1.7 19.68,19.05 v23.97,23.34
V_USB  (3 unrouted)
  Top 0.254: IC1.8 17.23,34.27 16.83,33.87 C1.1
VCCA  (via drill 0.35)  (5 unrouted)
  Top 0.254: U$1.1 27.94,17.62 v28.1,17.46 | U$1.19 27.3,25.72 27.62,26.04 L1.1 | R4.1 R5.1 22.86,16.83 21.75,15.72 18.57,15.72 16.83,17.46 J1.6 J1.3 18.89,28.42 21.75,28.42 22.86,27.3 R2.1 R3.1
  Bottom 0.254: J1.6 J1.3
VIN  (1 unrouted)
  Top 0.508: U1.VIN J7.1
  Bottom 0.508: U1.VIN J7.1